# EasyEDA Pro project ProPrj_EMU Button PCB_rev1.2.epro

# Schematic Schematic
Board Name: EMU_Multi_LED_Button_PCB; Create Date: 2026-03-17; Page Name: P1; Project Name: EMU Button PCB; Schematic Name: Schematic; Update Date: 2026-03-17; Company: EasyEDA.com; Page Size: A4; Version: V1.0
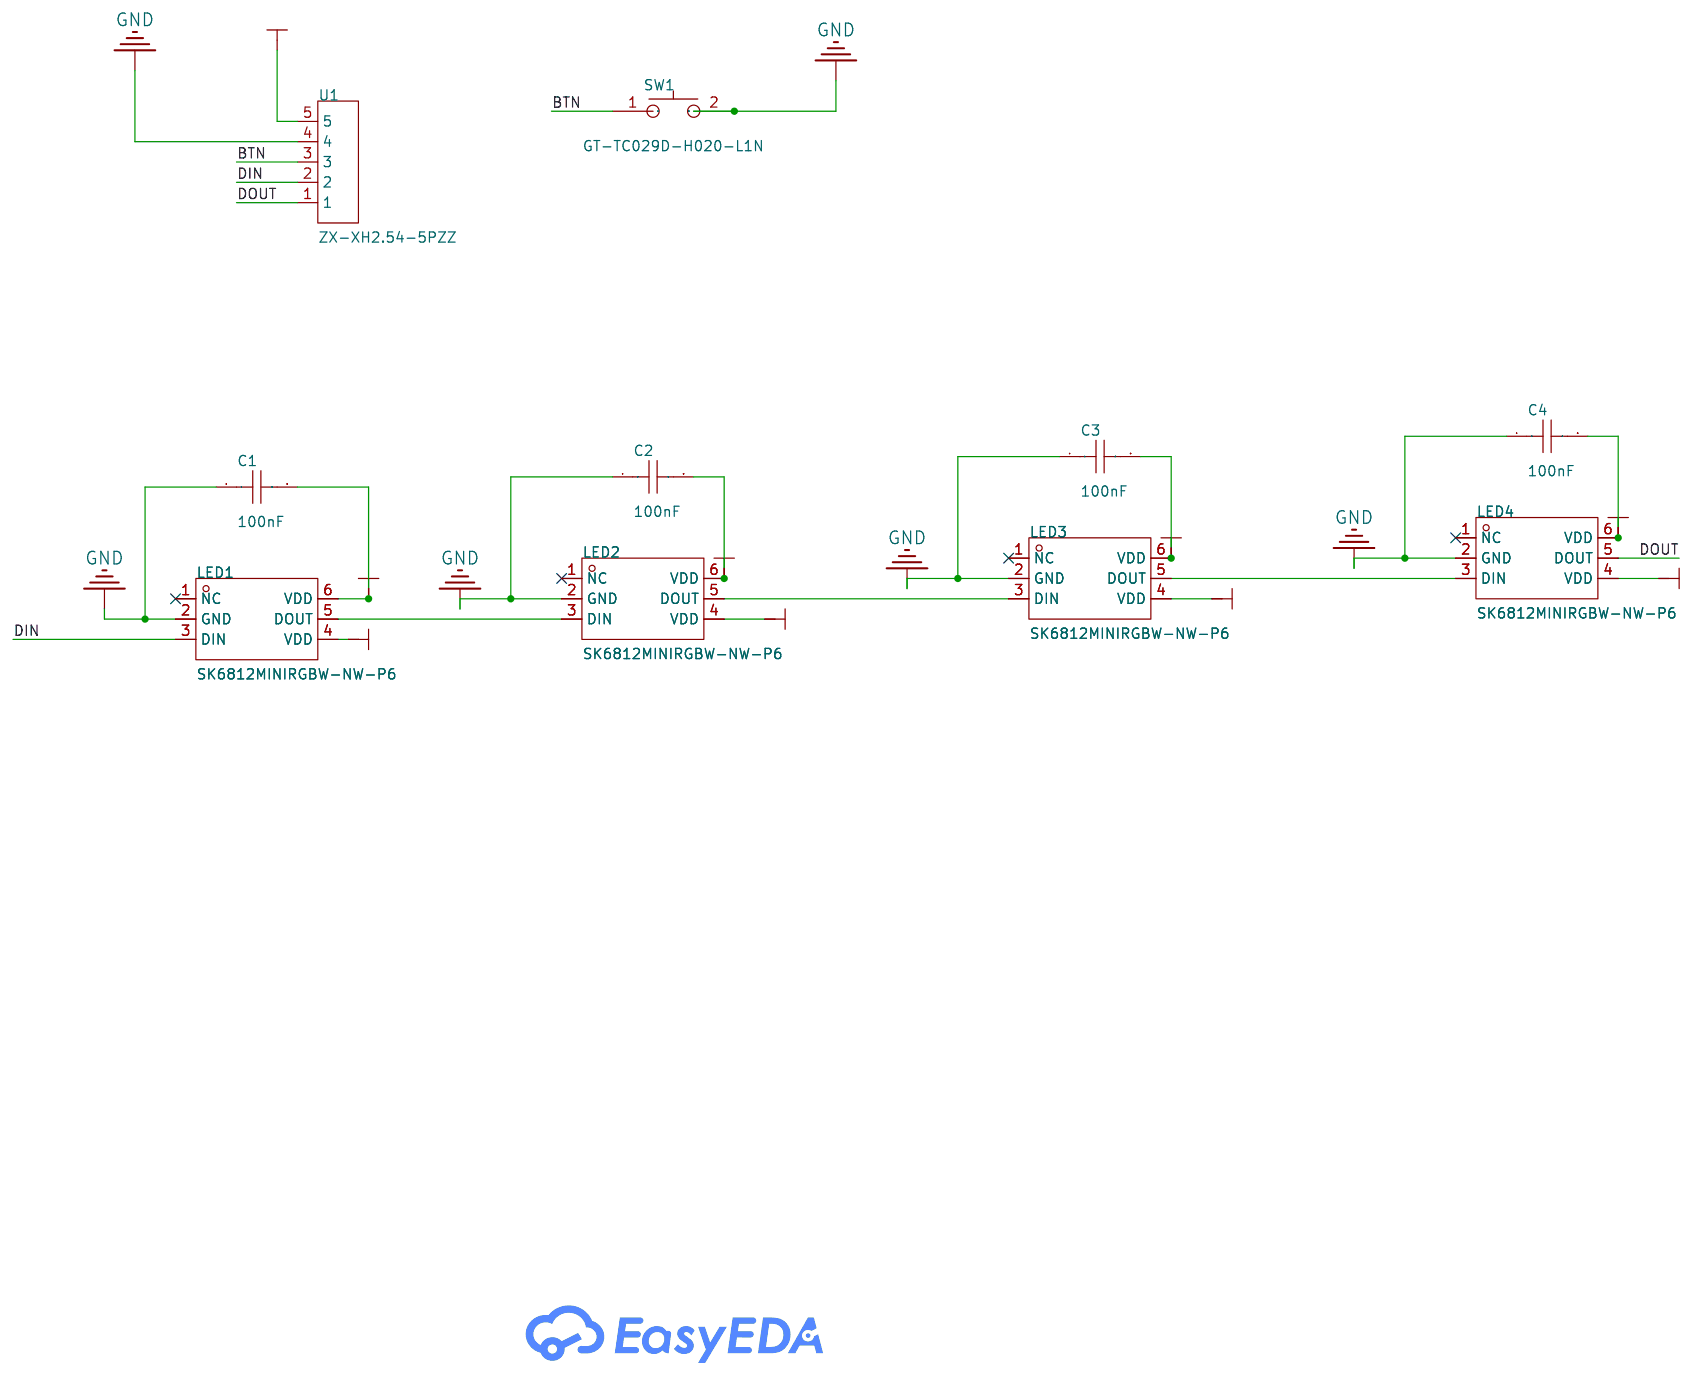
[diagram p0: schematic sheet]

## Parts
C1  100nF  [C0603]
C2  100nF  [C0603]
C3  100nF  [C0603]
C4  100nF  [C0603]
LED1  SK6812MINIRGBW-NW-P6  [LED-ARRAY-SMD_6P-L3.7-W3.5-TL-RD-1]
LED2  SK6812MINIRGBW-NW-P6  [LED-ARRAY-SMD_6P-L3.7-W3.5-TL-RD-1]
LED3  SK6812MINIRGBW-NW-P6  [LED-ARRAY-SMD_6P-L3.7-W3.5-TL-RD-1]
LED4  SK6812MINIRGBW-NW-P6  [LED-ARRAY-SMD_6P-L3.7-W3.5-TL-RD-1]
SW1  GT-TC029D-H020-L1N  [SW-SMD_L3.9-W2.9-LS4.8]
U1  ZX-XH2.54-5PZZ  [CONN-TH_5P-P2.50_ZX-XH2.54-5PZZ]

## Library data of the parts
C1-C4 = CC0603KRX7R9BB104: Capacitance:100nF Tolerance:±10% Tolerance:±10% Voltage Rating:50V Temperature Coefficient:X7R; LCSC Part Name: 100nF ±10% 50V; Supplier Part: C14663; Manufacturer: YAGEO(国巨); Supplier Footprint: 0603; JLCPCB Part Class: Basic Part; Datasheet: https://item.szlcsc.com/datasheet/CC0603KRX7R9BB104/15331.html; Supplier: LCSC; Tolerance: ±10%; Voltage Rating: 50V; Temperature Coefficient: X7R
LED1-LED4 = SK6812MINIRGBW-NW-P6: Supplier Part: C7423107; Manufacturer: 欧思科光电; Supplier Footprint: SMD-6P,3.7x3.5mm; JLCPCB Part Class: Extended Part; Datasheet: https://item.szlcsc.com/datasheet/SK6812MINIRGBW-NW-P6/8407580.html; Supplier: LCSC
SW1 = GT-TC029D-H020-L1N: Circuit:SPST Actuator Style:Round Button Operating Force:4N Mounting Type:Surface Mount,Vertical Length:4mm Width:3mm Switch Height:2mm with Bracket:Without Bracket Contact Current:50mA Voltage Rating:12V Actuator/Cap Color:Black With Lamp:No Termination; LCSC Part Name: 3.9*2.9*2mm 立贴 轻触开关; Supplier Part: C2837082; Manufacturer: G-Switch(品赞); Supplier Footprint: SMD; JLCPCB Part Class: Extended Part; Datasheet: https://item.szlcsc.com/datasheet/GT-TC029D-H020-L1N/3006450.html; Supplier: LCSC; Circuit: SPST; Actuator Style: Round Button; Operating Force: 4N; Mounting Type: Surface Mount,Vertical; Length: 4mm; Width: 3mm; Switch Height: 2mm; with Bracket: Without Bracket; Contact Current: 50mA; Voltage Rating: 12V; Actuator/Cap Color: Black; With Lamp: No; Termination Style: SMD(SMT) Tab; Life: 100,000 Cycles; Operating Temperature: -40℃~+85℃
U1 = ZX-XH2.54-5PZZ: Pins Structure:1x5P Pitch:2.5mm Mounting Type:Through Hole Reference Series:XH Number of Pins:5P Number of Rows:1 Number of PINs Per Row:5 Row Spacing:- Current Rating:3A Contact Material:Brass Contact Plating:Tin Operating Temperature:-25℃~+85℃ Operating; LCSC Part Name: 1x5P 间距:2.5mm 直插 系列:XH; Supplier Part: C7429635; Manufacturer: Megastar(兆星); Supplier Footprint: 插件,P=2.5mm; JLCPCB Part Class: Extended Part; Datasheet: https://item.szlcsc.com/datasheet/ZX-XH2.54-5PZZ/8427552.html; Supplier: LCSC; Pins Structure: 1x5P; Pitch: 2.5mm; Mounting Type: Through Hole; Reference Series: XH; Number of Pins: 5P; Number of Rows: 1; Number of PINs Per Row: 5; Current Rating: 3A; Contact Material: Brass; Contact Plating: Tin; Operating Temperature: -25℃~+85℃; Voltage Rating: 250V; Plastic Material: PA66; Flame Retardant Rating: UL94V-0; Color: White; Z-Height of the Board: 7mm; X-Length of Bottom Edge on Board (Spacing Line): 15mm; Y-Width of Bottom Edge on Board: 5.9mm

## Nets
GND: C1.1 C2.1 C3.1 C4.1 LED1.2(GND) LED2.2(GND) LED3.2(GND) LED4.2(GND) SW1.2 U1.4
VCC: C1.2 C2.2 C3.2 C4.2 LED1.4(VDD) LED1.6(VDD) LED2.4(VDD) LED2.6(VDD) LED3.4(VDD) LED3.6(VDD) LED4.4(VDD) LED4.6(VDD) U1.5
BTN: SW1.1 U1.3
DIN: LED1.3(DIN) U1.2
DOUT: LED4.5(DOUT) U1.1
$1N975: LED2.5(DOUT) LED3.3(DIN)
$1N981: LED1.5(DOUT) LED2.3(DIN)
$1N2893: LED3.5(DOUT) LED4.3(DIN)

Not connected (* = marked no-connect by the designer): LED1 1(NC)*; LED2 1(NC)*; LED3 1(NC)*; LED4 1(NC)*

# Board EMU_Multi_LED_Button_PCB
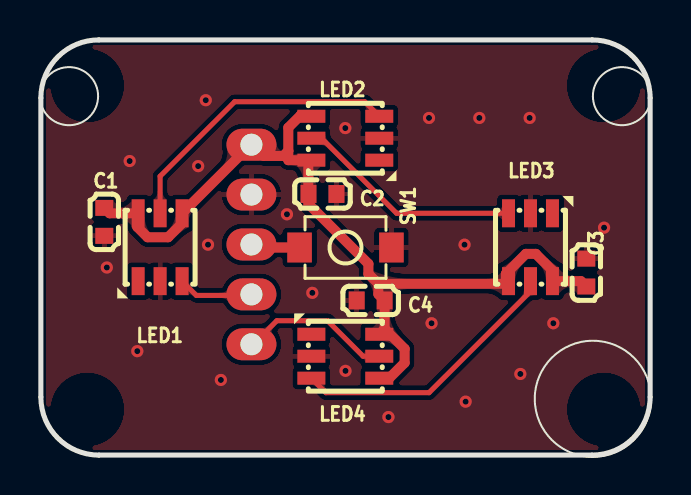
[diagram p1: board, top side]
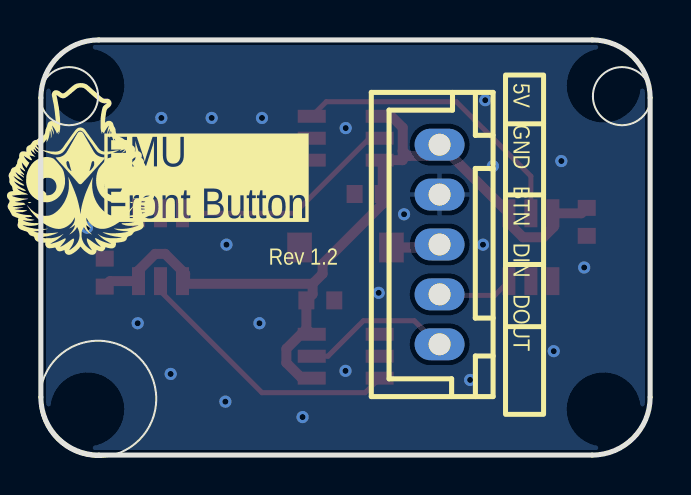
[diagram p2: board, bottom side, seen from below]

Outline 30.59 x 20.8 mm; copper layers: Top Layer, Bottom Layer. Coordinates in mm from the lower left corner of the outline.
Outline path: 0,15.52 0,5.3 0.05,2.9 ; 0,5.73 0,6.75 ; 0,2.82 0,4.05 ; 0.05,2.9 0.05,17.9 arc(0.9,19.95) 2.95,20.8 27.65,20.8 arc(29.7,19.95) 30.55,17.9 30.55,2.9 arc(29.7,0.85) 27.65,0 2.95,0 arc(0.9,0.85) 0.05,2.9 ; 30.59,17.98 30.59,13.02 ; 30.59,15.07 30.59,14.05 ; 30.59,7.78 30.59,7.77 ; 30.59,6.16 30.59,2.82
Stack: Top Layer 0.035mm / Dielectric1 1.51mm FR4 er 4.5 / Bottom Layer 0.035mm

## Design rules (mm)
template: Custom Config
spacing copperThickness1oz (default): track to track 0.102, other pairs 0.152 to 0.3
spacing copperThickness2oz: track to track 0.203, other pairs 0.152 to 0.3
track width copperThickness1oz (default): min 0.254, default 0.254, max 2.54
track width copperThickness2oz: min 0.254, default 0.254, max 2.54
track width power: min 0.5, default 0.5, max 2.54
differential pair differentialPair (default): width min 0.127, default 0.254, max 2.54; gap min 0.152, default 0.152
via viaSize (default): diameter min 0.5, default 0.61, max 10; hole min 0.3, default 0.305, max 6.3
net GND uses power
net VCC uses power

## Placement (name value [footprint] x y rotation side)
C1  100nF  [C0603]  3.22 11.68 90 top
C2  100nF  [C0603]  14.14 13.08 180 top
C3  100nF  [C0603]  27.35 9.14 270 top
C4  100nF  [C0603]  16.56 7.75 0 top
LED1  SK6812MINIRGBW-NW-P6  [LED-ARRAY-SMD_6P-L3.7-W3.5-TL-RD-1]  6.01 10.41 90 top
LED2  SK6812MINIRGBW-NW-P6  [LED-ARRAY-SMD_6P-L3.7-W3.5-TL-RD-1]  15.29 15.88 180 top
LED3  SK6812MINIRGBW-NW-P6  [LED-ARRAY-SMD_6P-L3.7-W3.5-TL-RD-1]  24.56 10.41 270 top
LED4  SK6812MINIRGBW-NW-P6  [LED-ARRAY-SMD_6P-L3.7-W3.5-TL-RD-1]  15.29 4.95 0 top
SW1  GT-TC029D-H020-L1N  [SW-SMD_L3.9-W2.9-LS4.8]  15.3 10.4 0 top
U1  ZX-XH2.54-5PZZ  [CONN-TH_5P-P2.50_ZX-XH2.54-5PZZ]  10.59 10.55 90 bottom

## Footprints (pads in the part's own frame, mm; a bottom-side part is the same pattern mirrored in y, then rotated)
C0603
  rect 0.8x0.9 smd: 1(-0.7,0) 2(0.7,0)
CONN-TH_5P-P2.50_ZX-XH2.54-5PZZ
  oval 1.6x2.5 hole 1.1: 1(-5,0) 2(-2.5,0) 3(0,0) 4(2.5,0) 5(5,0)
LED-ARRAY-SMD_6P-L3.7-W3.5-TL-RD-1
  rect 1.4x0.65 smd: 1(-1.7,1.1) 2(-1.7,0) 3(-1.7,-1.1) 4(1.7,-1.1) 5(1.7,0) 6(1.7,1.1)
SW-SMD_L3.9-W2.9-LS4.8
  rect 1.23x1.5 smd: 1(-2.3,0) 2(2.3,0)

## Nets
As in the schematic.

Pads without a net: LED1 1; LED2 1; LED3 1; LED4 1

## Via types
v1: diameter 0.61, hole 0.305, Top Layer to Bottom Layer, 21 vias

## Routing (per net, layer and track width the routed paths; a pad name or vN(x,y) marks a point on that pad's centre or on a via; arc(x,y) is an arc through that point)
GND:
  vias: v1(3.35,9.4) v1(4.49,14.73) v1(4.87,5.21) v1(7.92,14.48) v1(8.3,17.78) v1(8.41,10.54) v1(9.06,3.76) v1(12.36,12.06) v1(13.63,8.13) v1(15.29,16.38) v1(15.3,4.22) v1(17.44,1.91) v1(19.48,16.89) v1(19.6,6.6) v1(21.25,10.54) v1(21.31,2.68) v1(22,16.89) v1(24.05,4.06) v1(24.51,16.89) v1(25.7,6.6) v1(28.24,11.39)
VCC: length 43.7
  Top Layer w0.5: 12.43,15.24 12.43,16.41 13.04,17.02 13.54,17.02 LED2.4 ; 12.43,15.24 12.18,14.99 11.22,14.99 10.59,15.62 10.59,15.59 LED1.4 7.11,11.61 6.41,10.91 5.39,10.91 4.87,11.43 4.87,12.07 LED1.6 3.49,12.11 C1.2 ; 12.43,15.24 12.43,14.78 13.43,14.78 ; 13.43,14.78 LED2.6 ; 13.43,14.78 13.43,13.09 13.44,13.08 13.44,12.58 16.44,9.58 16.44,9.08 16.94,8.58 ; 17.26,6.32 LED4.6 ; 17.26,6.32 18.26,5.32 18.26,4.62 17.49,3.85 16.99,3.85 ; 17.26,6.32 C4.2 16.94,8.06 16.94,8.58 ; 16.94,8.58 23.32,8.58 ; 23.32,8.58 23.32,9.08 24.32,10.08 24.82,10.08 25.66,9.25 LED3.6 27.08,8.71 C3.2 ; 23.32,8.58 LED3.4
DIN: length 3.8
  Top Layer w0.254: LED1.3 7.83,8 10.59,8
DOUT: length 7.7
  Top Layer w0.254: 10.59,5.46 11.86,6.73 14.4,6.73 16.17,4.95 LED4.5
$1N975: length 11.4
  Top Layer w0.254: LED3.3 17.85,12.11 14.09,15.88 LED2.5
$1N981: length 14.7
  Top Layer w0.254: LED1.5 6.01,13.97 9.75,17.7 16.26,17.7 LED2.3
$1N2893: length 13.9
  Top Layer w0.254: LED3.5 24.56,8.21 19.48,3.13 14.31,3.13 13.59,3.85
BTN: length 2.7
  Top Layer w0.254: 13.15,10.4 13,10.54
  Top Layer w0.508: 10.59,10.54 10.73,10.4 SW1.1

## Copper pours and planes (outline as drawn; the poured copper is in the pictures)
GND on Top Layer: -1.22,21.59 31.67,21.59 31.67,-0.89 -1.22,-0.89
GND on Top Layer: -0.84,21.72 31.67,21.72 31.67,-1.14 -0.84,-1.14
GND on Top Layer: -1.49,22.48 32.56,22.48 32.56,-2.16 -1.49,-2.16
GND on Top Layer: -2.37,23.24 32.69,23.24 32.69,-2.29 -2.37,-2.29
GND on Top Layer: 0.05,17.9 0.05,18.11 0.1,18.46 0.19,18.79 0.31,19.11 0.47,19.41 0.67,19.69 0.9,19.95 1.15,20.18 1.43,20.37 1.74,20.54 2.06,20.66 2.39,20.75 2.73,20.79 2.95,20.8 27.65,20.8 27.86,20.79 28.2,20.75 28.53,20.66 28.85,20.54 29.16,20.37 29.44,20.18 29.7,19.95 29.92,19.69 30.12,19.41 30.28,19.11 30.41,18.79 30.49,18.46 30.54,18.11 30.55,17.9 30.55,2.9 30.54,2.69 30.49,2.34 30.41,2.01 30.28,1.69 30.12,1.39 29.92,1.11 29.7,0.85 29.44,0.62 29.16,0.43 28.85,0.26 28.53,0.14 28.2,0.05 27.86,0.01 27.65,0 2.95,0 2.73,0.01 2.39,0.05 2.06,0.14 1.74,0.26 1.43,0.43 1.15,0.62 0.9,0.85 0.67,1.11 0.47,1.39 0.31,1.69 0.19,2.01 0.1,2.34 0.05,2.69 0.05,2.9
GND on Top Layer: -1.86,23.24 32.3,23.24 32.3,-1.78 -1.86,-1.78
GND on Top Layer: -1.86,22.99 31.41,22.99 31.41,-1.91 -1.86,-1.91
GND on Top Layer: -1.73,22.48 31.8,22.48 31.8,-1.78 -1.73,-1.78
GND on Bottom Layer: 0.05,17.9 0.05,18.11 0.1,18.46 0.19,18.79 0.31,19.11 0.47,19.41 0.67,19.69 0.9,19.95 1.15,20.18 1.43,20.37 1.74,20.54 2.06,20.66 2.39,20.75 2.73,20.79 2.95,20.8 27.65,20.8 27.86,20.79 28.2,20.75 28.53,20.66 28.85,20.54 29.16,20.37 29.44,20.18 29.7,19.95 29.92,19.69 30.12,19.41 30.28,19.11 30.41,18.79 30.49,18.46 30.54,18.11 30.55,17.9 30.55,2.9 30.54,2.69 30.49,2.34 30.41,2.01 30.28,1.69 30.12,1.39 29.92,1.11 29.7,0.85 29.44,0.62 29.16,0.43 28.85,0.26 28.53,0.14 28.2,0.05 27.86,0.01 27.65,0 2.95,0 2.73,0.01 2.39,0.05 2.06,0.14 1.74,0.26 1.43,0.43 1.15,0.62 0.9,0.85 0.67,1.11 0.47,1.39 0.31,1.69 0.19,2.01 0.1,2.34 0.05,2.69 0.05,2.9
GND on Bottom Layer: -2.75,23.62 34.21,23.62 34.21,-3.94 -2.75,-3.94

Small or netless copper shapes (teardrops, artwork), in the pictures only: 30 on Top Layer

## Text on the board
Bottom Silkscreen Layer: 5V   GND   BTN   DIN   DOUT | Rev 1.2 | EMU / Front Button
